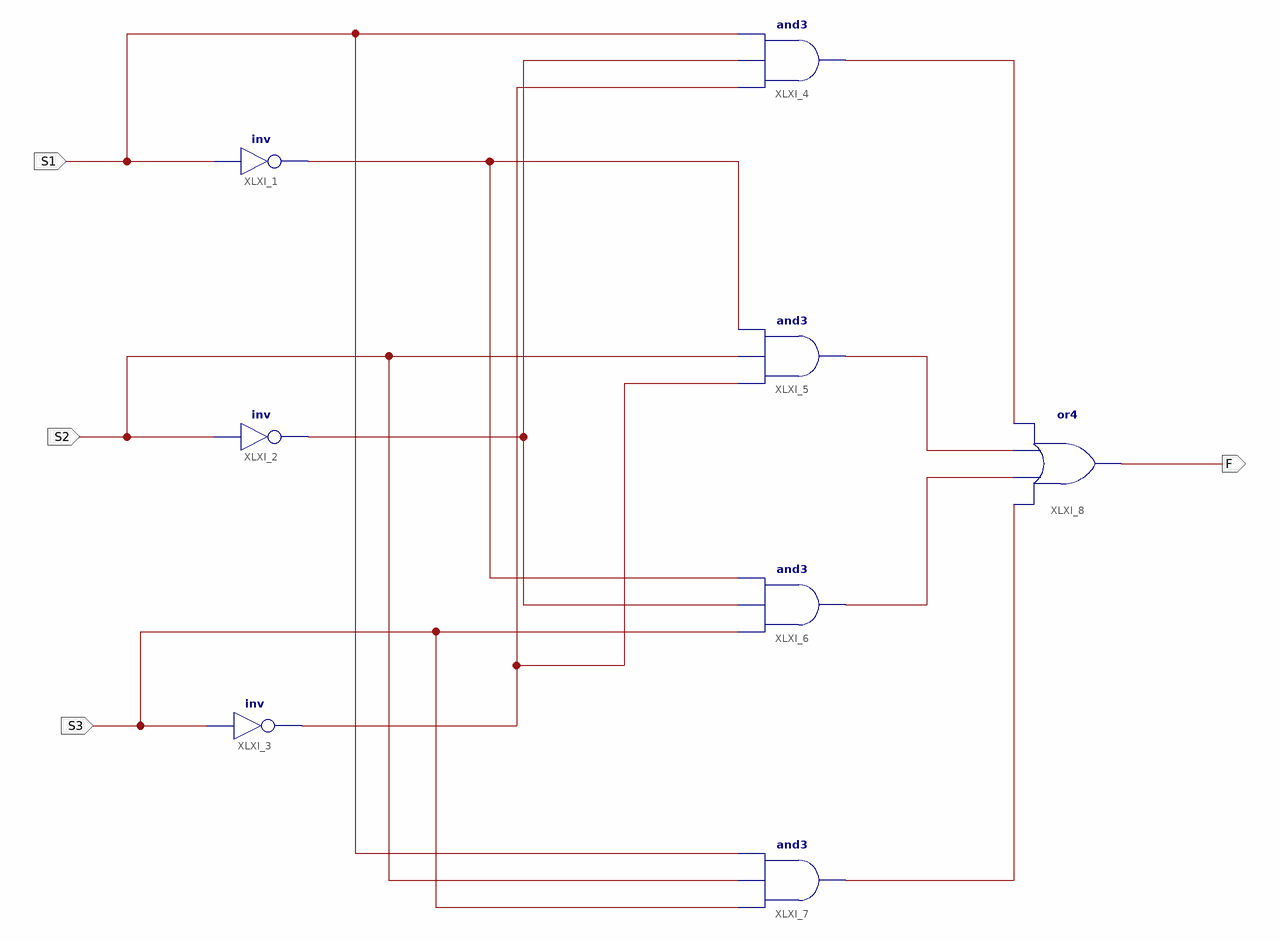
[diagram p0: schematic sheet 1]
// Xilinx ISE schematic LampCtrl.sch (kintex7) as structural Verilog: 8 symbols, 4 ports
module LampCtrl (
  input  S1,
  input  S2,
  input  S3,
  output F
);

  wire XLXN_7, XLXN_10, XLXN_17, XLXN_18, XLXN_19, XLXN_20, XLXN_21;

  not XLXI_1 (XLXN_7, S1);
  not XLXI_2 (XLXN_10, S2);
  not XLXI_3 (XLXN_17, S3);
  and XLXI_4 (XLXN_18, XLXN_17, XLXN_10, S1);
  and XLXI_5 (XLXN_19, XLXN_17, S2, XLXN_7);
  and XLXI_6 (XLXN_20, S3, XLXN_10, XLXN_7);
  and XLXI_7 (XLXN_21, S3, S2, S1);
  or XLXI_8 (F, XLXN_21, XLXN_20, XLXN_19, XLXN_18);
endmodule
